# Altium schematic sheet Battery Voltaege Sense.SchDoc
size A; SheetNumber: 6; SheetTotal: 14
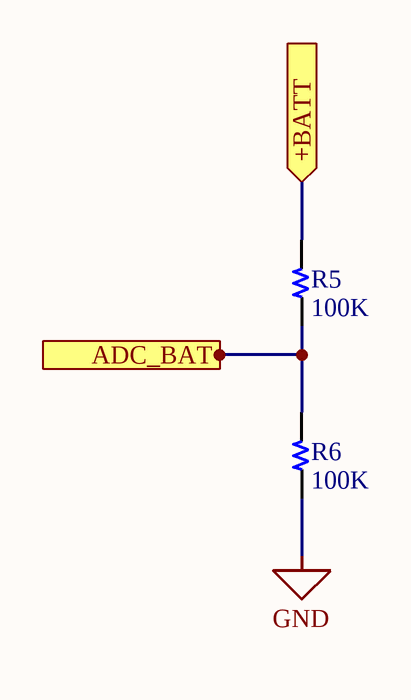
[diagram p0: Battery Voltaege Sense.SchDoc]

## Parts
R5  100K  [R 0805]
R6  100K  [R 0805]

## Ports
+BATT (in, see ESP32[4B], Battery Charging[2B], USB Input[3B]), ADC_BAT (out, see ESP32[3B])

## Nets
GND: R6.1
+BATT: R5.2 ; port +BATT
ADC_BAT: R5.1 R6.2 ; port ADC_BAT

## Library data of the parts
R5 R6 = Resistor